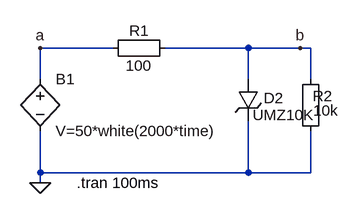
[diagram p0: schematic VL-P-N3.asc]
VL-P-N3.asc, the LTspice schematic file:
Version 4
SHEET 1 880 680
WIRE 48 112 -64 112
WIRE 256 112 128 112
WIRE 336 112 256 112
WIRE 352 112 336 112
WIRE -64 160 -64 112
WIRE 256 160 256 112
WIRE 352 160 352 112
WIRE -64 304 -64 240
WIRE 256 304 256 224
WIRE 256 304 -64 304
WIRE 352 304 352 240
WIRE 352 304 256 304
WIRE -64 320 -64 304
FLAG -64 112 a
FLAG 336 112 b
FLAG -64 320 0
SYMBOL Misc\\EuropeanResistor 144 96 R90
WINDOW 0 5 56 VBottom 2
WINDOW 3 27 56 VTop 2
SYMATTR InstName R1
SYMATTR Value 100
SYMBOL Misc\\EuropeanResistor 368 256 R180
WINDOW 0 -18 70 Left 2
WINDOW 3 -27 48 Left 2
SYMATTR InstName R2
SYMATTR Value 10k
SYMBOL zener 240 160 R0
WINDOW 0 40 29 Left 2
WINDOW 3 23 55 Left 2
SYMATTR InstName D2
SYMATTR Value UMZ10K
SYMATTR Description Diode
SYMATTR Type diode
SYMBOL bv -64 144 R0
SYMATTR InstName B1
SYMATTR Value V=50*white(2000*time)
TEXT -8 320 Left 2 !.tran 100ms

The netlist it stands for:
* VL-P-N3.asc
R1 b a 100
R2 0 b 10k
D2 b 0 UMZ10K
B1 a 0 V=50*white(2000*time)
.model D D
.lib standard.dio
.tran 100ms
.backanno
.end